# EAGLE design motherboard_v4 (EAGLE 9.1.3)
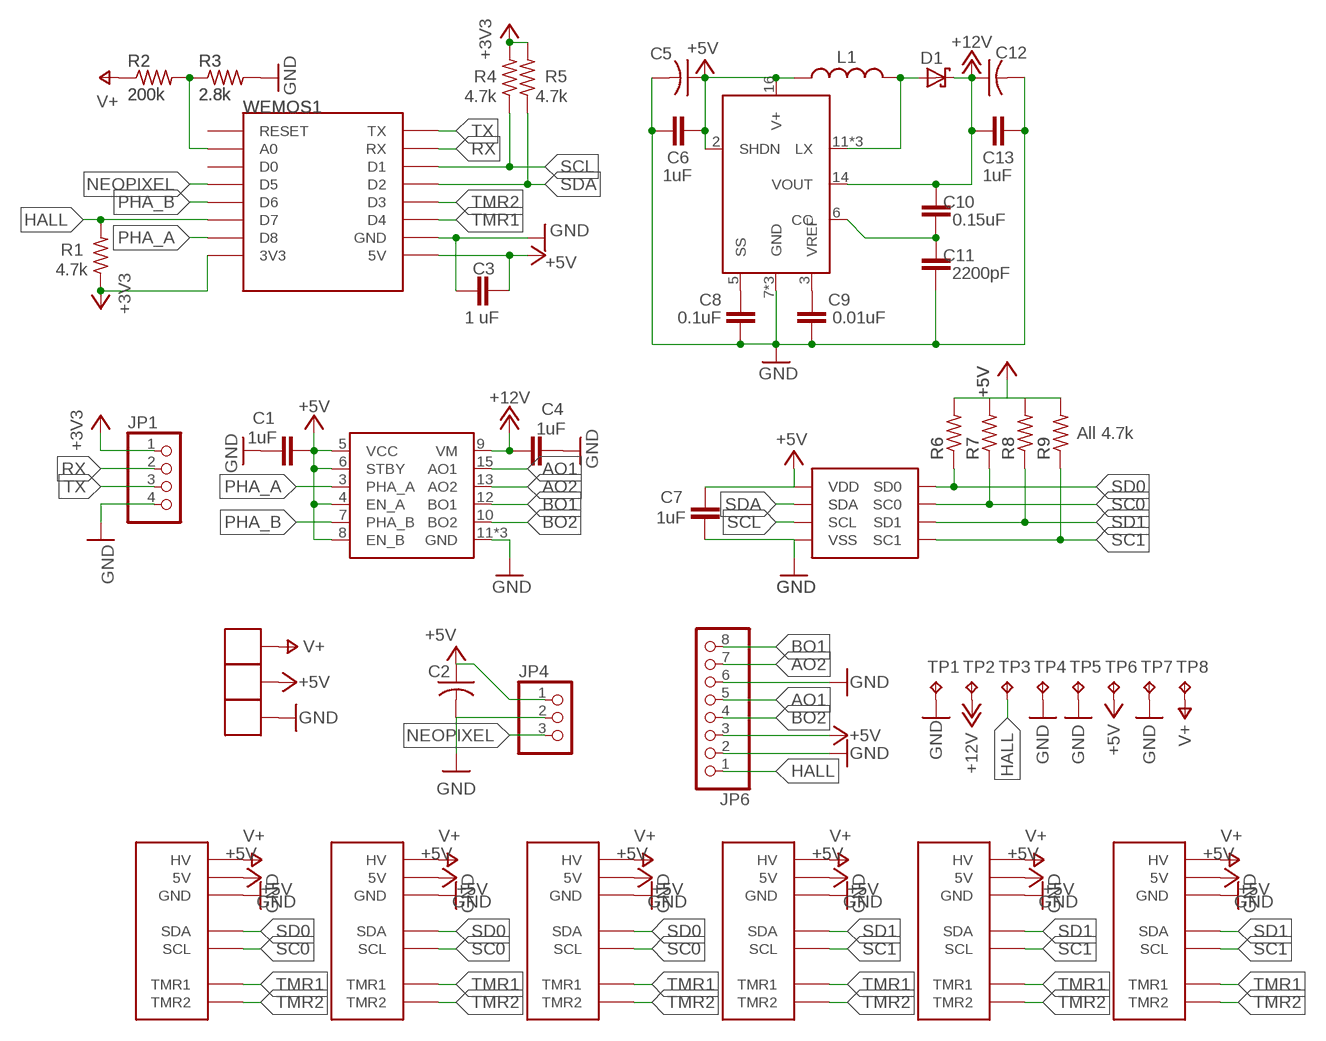
[diagram p0: schematic, sheet 1]

## Parts
C1  1uF  C-EUC1206  [C1206]
C2  UCM1H331MNL1GS  [CAPAE1030X1050]
C3  1 uF  C-EUC1206  [C1206]
C4  1uF  C-EUC1206  [C1206]
C5  UCM1H331MNL1GS  [CAPAE1030X1050]
C6  1uF  C-EUC1206  [C1206]
C7  1uF  C-EUC1206  [C1206]
C8  0.1uF  C-EUC1206  [C1206]
C9  0.01uF  C-EUC1206  [C1206]
C10  0.15uF  C-EUC1206  [C1206]
C11  2200pF  C-EUC1206  [C1206]
C12  UCM1H331MNL1GS  [CAPAE1030X1050]
C13  1uF  C-EUC1206  [C1206]
D1  NSR0530H  [SOD2512X100]
J1  PHOENIX_1731468  [PHOENIX_1731468]
J2  PHOENIX_1731468  [PHOENIX_1731468]
J3  PHOENIX_1731468  [PHOENIX_1731468]
JP1  PINHD-1X4  [1X04]
JP2  PCIE_SOCKET  [PCIE_SOCKET]
JP3  PCIE_SOCKET  [PCIE_SOCKET]
JP4  PINHD-1X3  [1X03]
JP5  PCIE_SOCKET  [PCIE_SOCKET]
JP6  PINHD-1X8  [1X08]
JP7  PCIE_SOCKET  [PCIE_SOCKET]
JP8  PCIE_SOCKET  [PCIE_SOCKET]
JP9  PCIE_SOCKET  [PCIE_SOCKET]
L1  NR6028  [NR6028]
R1  4.7k  R-US_R1206  [R1206]
R2  200k  R-US_R1206  [R1206]
R3  2.8k  R-US_R1206  [R1206]
R4  4.7k  R-US_R1206  [R1206]
R5  4.7k  R-US_R1206  [R1206]
R6  R-US_R1206  [R1206]
R7  R-US_R1206  [R1206]
R8  R-US_R1206  [R1206]
R9  R-US_R1206  [R1206]
TP1  TPB2,54  [B2,54]
TP2  TPB2,54  [B2,54]
TP3  TPB2,54  [B2,54]
TP4  TPB2,54  [B2,54]
TP5  TPB2,54  [B2,54]
TP6  TPB2,54  [B2,54]
TP7  TPB2,54  [B2,54]
TP8  TPB2,54  [B2,54]
U1  TC78H620FNG  [SSOP16]
U2  MAX732  [SOIC127P1032X265-16]
U3  PCA9540BDPSOIC8  [SOIC127P599X175-8]
WEMOS1  WEMOS-D1-MINISMD  [WEMOS-D1-MINI-SMD]

## Nets
+3V3: JP1.1 R1.1 R4.2 R5.2 WEMOS1.3V3
+5V: C1.2 C2.1 C3.2 C5.1 C6.1 C7.2 J2.P$1 J2.P$2 JP2.5V1(5V) JP2.5V2(5V) JP3.5V1(5V) JP3.5V2(5V) JP4.1 JP5.5V1(5V) JP5.5V2(5V) JP6.3 JP7.5V1(5V) JP7.5V2(5V) JP8.5V1(5V) JP8.5V2(5V) JP9.5V1(5V) JP9.5V2(5V) L1.1 R6.2 R7.2 R8.2 R9.2 TP6.TP U1.4(EN_A) U1.5(VCC) U1.6(STBY) U1.8(EN_B) U2.2(SHDN) U2.16(V+) U3.3(VDD) WEMOS1.5V
+12V: C4.1 C10.2 C12.1 C13.2 D1.1(C) TP2.TP U1.9(VM) U2.14(VOUT)
AO1: JP6.5 U1.15(AO1)
AO2: JP6.7 U1.13(AO2)
BO1: JP6.8 U1.12(BO1)
BO2: JP6.4 U1.10(BO2)
GND: C1.1 C2.2 C3.1 C4.2 C5.2 C6.2 C7.1 C8.1 C9.1 C11.1 C12.2 C13.1 J3.P$1 J3.P$2 JP1.4 JP2.GND1(GND) JP2.GND2(GND) JP3.GND1(GND) JP3.GND2(GND) JP4.2 JP5.GND1(GND) JP5.GND2(GND) JP6.2 JP6.6 JP7.GND1(GND) JP7.GND2(GND) JP8.GND1(GND) JP8.GND2(GND) JP9.GND1(GND) JP9.GND2(GND) R3.2 TP1.TP TP4.TP TP5.TP TP7.TP U1.11(GND) U1.14(GND) U1.16(GND) U2.7(GND) U2.8(GND) U2.9(GND) U3.6(VSS) WEMOS1.GND
HALL: JP6.1 R1.2 TP3.TP WEMOS1.D7
N$1: D1.2(A) L1.2 U2.11(LX) U2.12(LX) U2.13(LX)
N$3: C10.1 C11.2 U2.6(CC)
N$4: C9.2 U2.3(VREF)
N$5: C8.2 U2.5(SS)
N$23: R2.2 R3.1 WEMOS1.A0
NEOPIXEL: JP4.3 WEMOS1.D5
PHA_A: U1.3(PHA_A) WEMOS1.D8
PHA_B: U1.7(PHA_B) WEMOS1.D6
RX: JP1.2 WEMOS1.RX
SC0: JP2.SCL1(SCL) JP2.SCL2(SCL) JP3.SCL1(SCL) JP3.SCL2(SCL) JP5.SCL1(SCL) JP5.SCL2(SCL) R7.1 U3.5(SC0)
SC1: JP7.SCL1(SCL) JP7.SCL2(SCL) JP8.SCL1(SCL) JP8.SCL2(SCL) JP9.SCL1(SCL) JP9.SCL2(SCL) R9.1 U3.8(SC1)
SCL: R4.1 U3.1(SCL) WEMOS1.D1
SD0: JP2.SDA1(SDA) JP2.SDA2(SDA) JP3.SDA1(SDA) JP3.SDA2(SDA) JP5.SDA1(SDA) JP5.SDA2(SDA) R6.1 U3.4(SD0)
SD1: JP7.SDA1(SDA) JP7.SDA2(SDA) JP8.SDA1(SDA) JP8.SDA2(SDA) JP9.SDA1(SDA) JP9.SDA2(SDA) R8.1 U3.7(SD1)
SDA: R5.1 U3.2(SDA) WEMOS1.D2
TMR1: JP2.TMR1_1(TMR1) JP2.TMR1_2(TMR1) JP3.TMR1_1(TMR1) JP3.TMR1_2(TMR1) JP5.TMR1_1(TMR1) JP5.TMR1_2(TMR1) JP7.TMR1_1(TMR1) JP7.TMR1_2(TMR1) JP8.TMR1_1(TMR1) JP8.TMR1_2(TMR1) JP9.TMR1_1(TMR1) JP9.TMR1_2(TMR1) WEMOS1.D4
TMR2: JP2.TMR2_1(TMR2) JP2.TMR2_2(TMR2) JP3.TMR2_1(TMR2) JP3.TMR2_2(TMR2) JP5.TMR2_1(TMR2) JP5.TMR2_2(TMR2) JP7.TMR2_1(TMR2) JP7.TMR2_2(TMR2) JP8.TMR2_1(TMR2) JP8.TMR2_2(TMR2) JP9.TMR2_1(TMR2) JP9.TMR2_2(TMR2) WEMOS1.D3
TX: JP1.3 WEMOS1.TX
V+: J1.P$1 J1.P$2 JP2.HV1(HV) JP2.HV2(HV) JP3.HV1(HV) JP3.HV2(HV) JP5.HV1(HV) JP5.HV2(HV) JP7.HV1(HV) JP7.HV2(HV) JP8.HV1(HV) JP8.HV2(HV) JP9.HV1(HV) JP9.HV2(HV) R2.1 TP8.TP
Unconnected: WEMOS1.D0 WEMOS1.RST(RESET)

## Notes on the sheet
- All 4.7k

## Library data of the parts
C1 C3 C4 C6-C11 C13 = resistor:C-EU: CAPACITOR, European symbol
C2 C5 C12 = tide_clock:UCM1H331MNL1GS
D1 = tide_clock:NSR0530H
J1-J3 = tide_clock:PHOENIX_1731468
JP1 = pinhead:PINHD-1X4: PIN HEADER
JP2 JP3 JP5 JP7-JP9 = tide_clock:PCIE_SOCKET
JP4 = pinhead:PINHD-1X3: PIN HEADER
JP6 = pinhead:PINHD-1X8: PIN HEADER
L1 = tide_clock:NR6028
R1-R9 = resistor:R-US_: RESISTOR, American symbol
TP1-TP8 = testpad:TP: Test pad
U1 = tide_clock:TC78H620FNG
U2 = tide_clock:MAX732
U3 = tide_clock:PCA9540BDP
WEMOS1 = tide_clock:WEMOS-D1-MINI: WeMos.cc D1 mini ESP8266 module

## Board
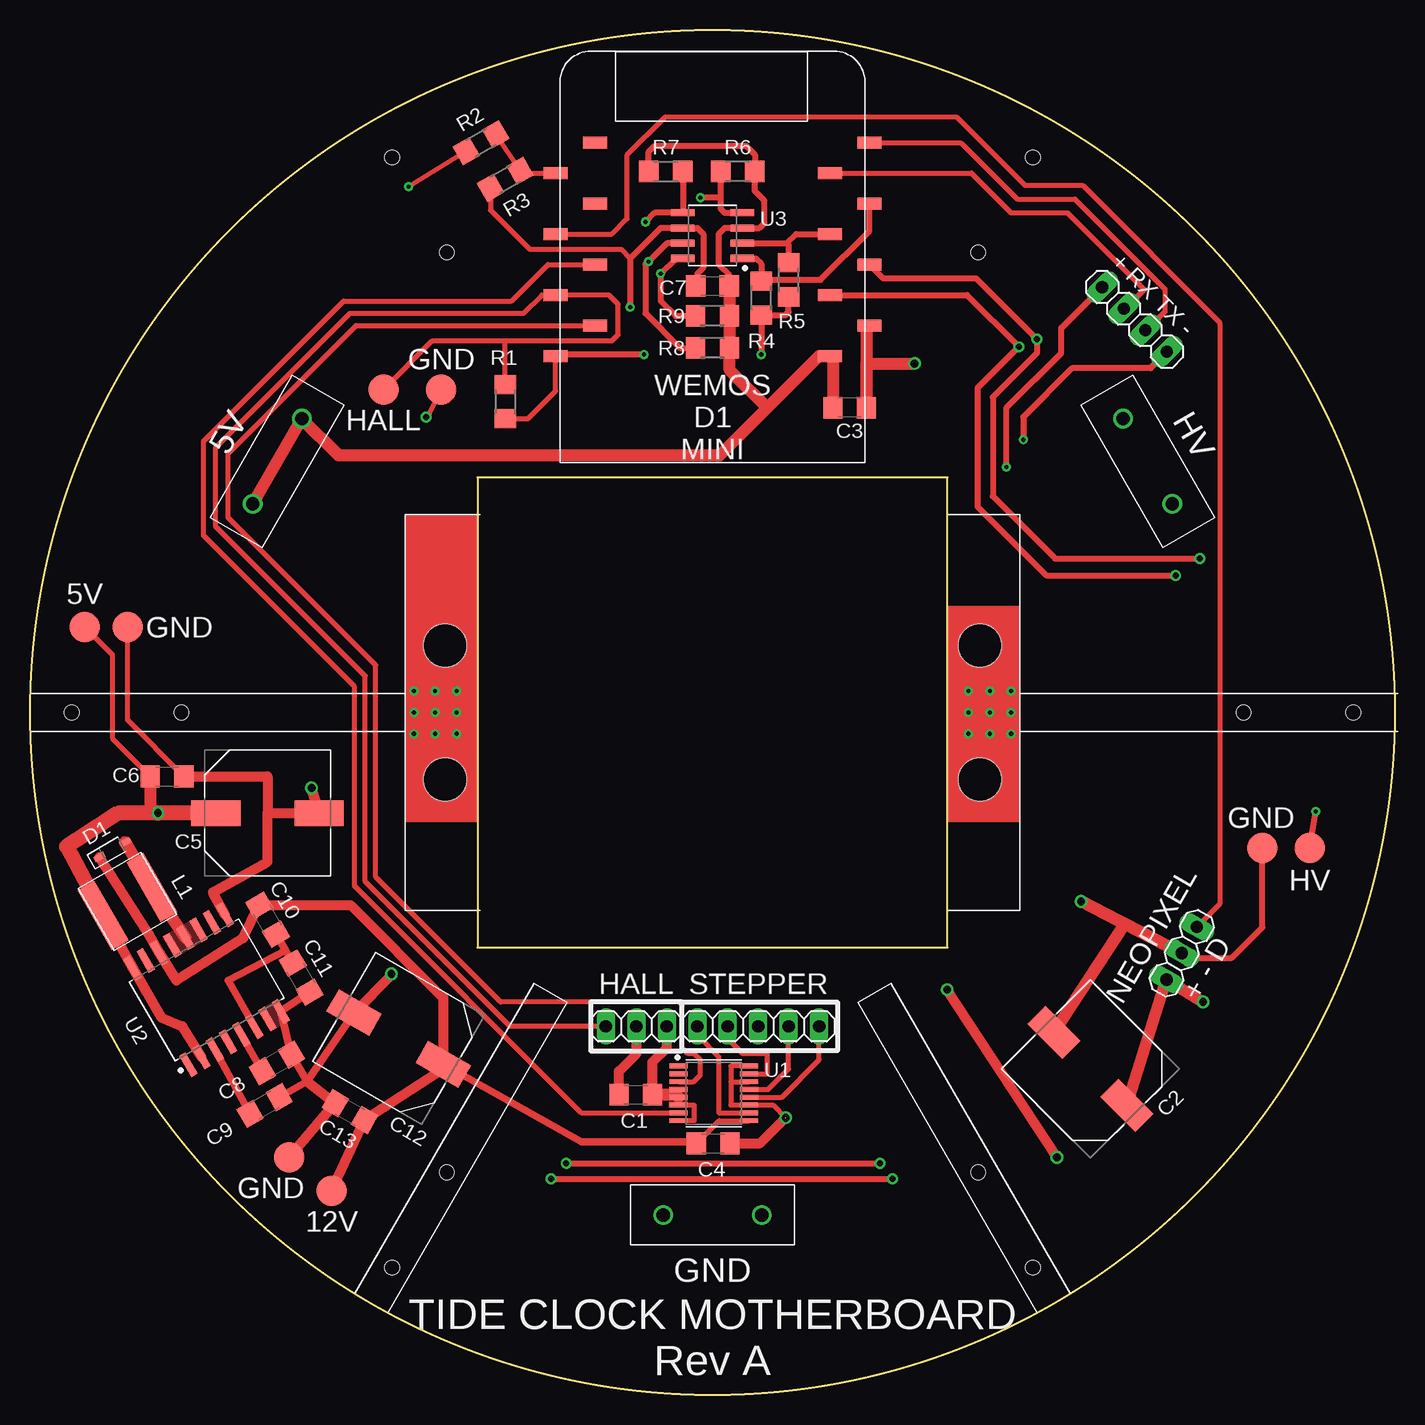
[diagram p1: board, top side]
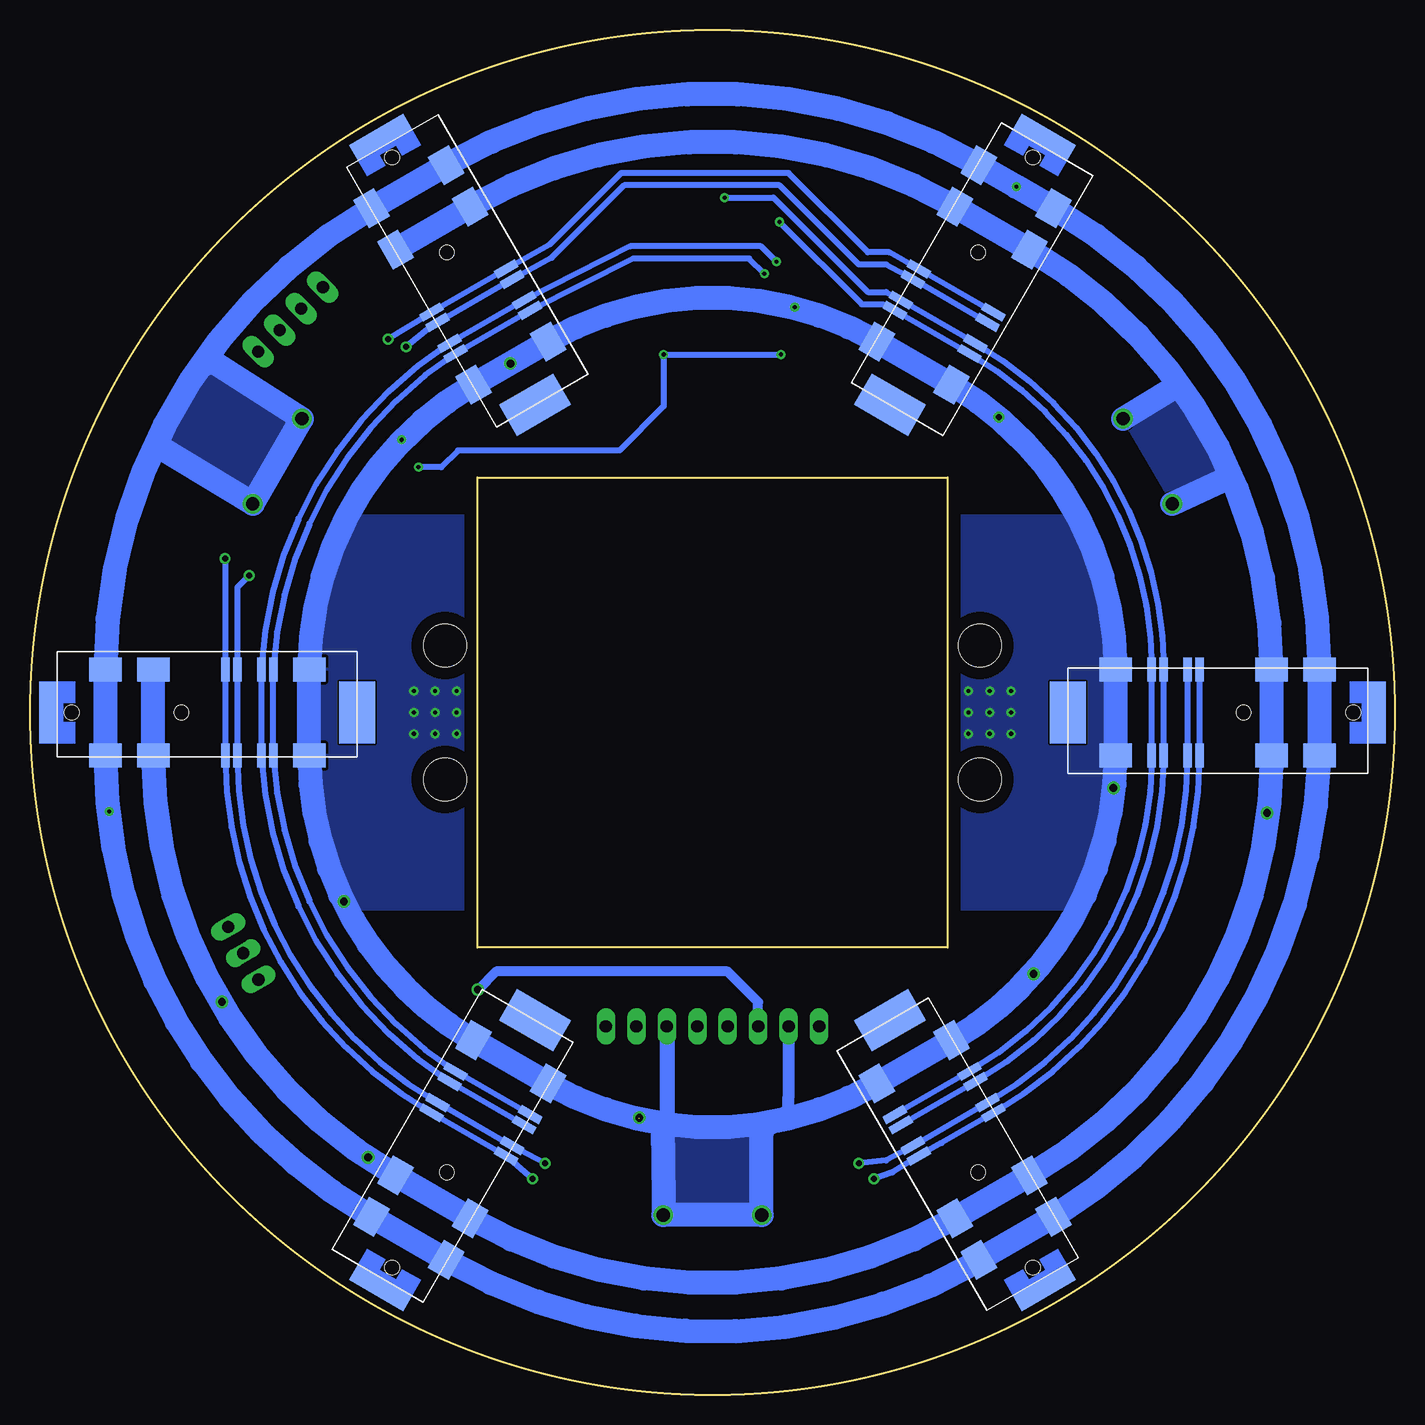
[diagram p2: board, bottom side, seen from below]

Size 113.79 x 113.79 mm. Coordinates in mm from the lower left corner, seen from the top.
Outline: 37.3,37.3 76.49,37.3 76.49,76.49 37.3,76.49 37.3,37.3
Outline: circle at 56.9,56.9 radius 56.9
Copper layers (1*16): Top 0.035mm / dielectric 1.5mm / Bottom 0.035mm
Design rules "default *": minimum track width 6mil, minimum drill 0.35mm, track to track 6mil, track to pad 6mil, pad to pad 6mil, via to via 6mil, smd to smd 6mil, copper to edge 40mil, drill to drill 6mil, minimum pad ring 10mil, minimum via ring 8mil, stop-mask expansion 4mil, vias tented up to drill 30mil, thermal gap 10mil
Holes 3.56 mm at 79.19,51.32 79.19,62.47 34.6,51.32 34.6,62.47
Milling: 4 lines

### Footprints (pad centres in the part's own frame; a part is rotated, then mirrored left to right if it is on the bottom)
C1206 = smd 1.6 x 1.8: 1 -1.4,0; 2 1.4,0
CAPAE1030X1050 = smd 4.11 x 2.12: 1 -4.299,0; 2 4.299,0
SOD2512X100 = smd 0.945 x 0.497: 1 -1.235,0; 2 1.235,0
PHOENIX_1731468 = drill 1.1: P$1 4.1,0; P$2 -4.1,0
1X04 = drill 1.016 long: 1 -3.81,0; 2 -1.27,0; 3 1.27,0; 4 3.81,0
PCIE_SOCKET = smd 2.7 x 2: 5V1 2.5,3.6; 5V2 2.5,-3.6; GND1 -10.5,3.6; GND2 -10.5,-3.6; HV1 6.5,3.6; HV2 6.5,-3.6 | smd 3 x 5.2: LEFT_TAB -14.5,0 | smd 1.5 x 5.2: RIGHT_TAB 11.25,0 | smd 0.7 x 2: SCL1 -7.5,3.6; SCL2 -7.5,-3.6; SDA1 -6.5,3.6; SDA2 -6.5,-3.6; TMR1_1 -4.5,3.6; TMR1_2 -4.5,-3.6; TMR2_1 -3.5,3.6; TMR2_2 -3.5,-3.6 | hole 1.2: 0.15,0; 9.3,0
1X03 = drill 1.016 long: 1 -2.54,0; 2 0,0; 3 2.54,0
1X08 = drill 1.016 long: 1 -8.89,0; 2 -6.35,0; 3 -3.81,0; 4 -1.27,0; 5 1.27,0; 6 3.81,0; 7 6.35,0; 8 8.89,0
NR6028 = smd 1.6 x 5.7: 1 -2.35,0; 2 2.35,0
R1206 = smd 1.6 x 1.803: 1 -1.422,0; 2 1.422,0
B2,54 = smd 2.54 x 2.54: TP 0,0
SSOP16 = smd 1.515 x 0.409: 1 -2.948,2.275; 2 -2.948,1.625; 3 -2.948,0.975; 4 -2.948,0.325; 5 -2.948,-0.325; 6 -2.948,-0.975; 7 -2.948,-1.625; 8 -2.948,-2.275; 9 2.948,-2.275; 10 2.948,-1.625; 11 2.948,-0.975; 12 2.948,-0.325; 13 2.948,0.325; 14 2.948,0.975; 15 2.948,1.625; 16 2.948,2.275
SOIC127P1032X265-16 = smd 2.052 x 0.602: 1 -4.654,4.445; 2 -4.654,3.175; 3 -4.654,1.905; 4 -4.654,0.635; 5 -4.654,-0.635; 6 -4.654,-1.905; 7 -4.654,-3.175; 8 -4.654,-4.445; 9 4.654,-4.445; 10 4.654,-3.175; 11 4.654,-1.905; 12 4.654,-0.635; 13 4.654,0.635; 14 4.654,1.905; 15 4.654,3.175; 16 4.654,4.445
SOIC127P599X175-8 = smd 1.972 x 0.599: 1 -2.472,1.905; 2 -2.472,0.635; 3 -2.472,-0.635; 4 -2.472,-1.905; 5 2.472,-1.905; 6 2.472,-0.635; 7 2.472,0.635; 8 2.472,1.905
WEMOS-D1-MINI-SMD = smd 2.007 x 0.991: 3V3 -13.081,-10.16; 5V 9.779,-10.16; A0 -13.081,5.08; D0 -9.779,2.54; D1 13.081,2.54; D2 9.779,0; D3 13.081,-2.54; D4 9.779,-5.08; D5 -13.081,0; D6 -9.779,-2.54; D7 -13.081,-5.08; D8 -9.779,-7.62; GND 13.081,-7.62; RST -9.779,7.62; RX 9.779,5.08; TX 13.081,7.62

### Placement (x,y rotation side)
C1  50.5,25.04 0 top
C2  88.39,27.18 135 top
C3  68.33,82.3 180 top
C4  56.95,20.98 0 top
C5  19.81,48.51 0 top
C6  11.43,51.56 0 top
C7  56.9,92.46 0 top
C8  20.57,27.69 210 top
C9  19.56,24.13 210 top
C10  19.81,39.62 120 top
C11  22.61,34.8 120 top
C12  30.73,29.72 150 top
C13  26.67,23.62 330 top
D1  6.86,45.47 30 top
J1  93.18,77.84 120 top
J2  20.61,77.84 60 top
J3  56.9,15 180 top
JP1  92.08,89.66 315 top
JP2  34.84,95.1 60 bottom
JP3  12.78,56.9 0 bottom
JP4  96.01,36.83 60 top
JP5  34.84,18.69 300 bottom
JP6  56.9,30.73 0 top
JP7  78.95,18.69 240 bottom
JP8  101.01,56.9 180 bottom
JP9  78.95,95.1 120 bottom
L1  8.13,41.15 30 top
R1  39.62,82.8 90 top
R2  37.59,104.39 30 top
R3  39.62,101.35 210 top
R4  60.96,91.44 270 top
R5  63.25,92.96 270 top
R6  59,102 0 top
R7  53,102 180 top
R8  56.9,87.29 0 top
R9  56.9,89.97 0 top
TP1  21.59,19.81 0 top
TP2  25.15,17.02 0 top
TP3  29.46,83.82 0 top
TP4  34.29,83.82 0 top
TP5  8.13,64.01 0 top
TP6  4.57,64.01 0 top
TP7  102.74,45.59 0 top
TP8  106.68,45.59 0 top
U1  57,25.15 0 top
U2  14.73,33.78 120 top
U3  56.89,96.65 180 top
WEMOS1  56.89,96.77 0 top

### Tracks (layer width: path | path; a pad name or v marks a point on that pad's centre or on a via)
+3V3  (via drill 0.35)
  Top 0.406: R1.1 41.5,81.38 43.81,83.69 WEMOS1.3V3
  Top 0.508: R5.2 63.25,90.3 62.97,90.02 R4.2 v60.96,86.74 | v51.18,86.74 43.94,86.74 WEMOS1.3V3 | v81.41,77.34 81.41,82.3 85.98,86.87 85.98,88.95 JP1.1
  Bottom 0.508: v51.18,86.74 v60.96,86.74 60.96,82.42 64.64,78.74 78.11,78.74 79.5,77.34 v81.41,77.34
+5V  (via drill 0.65)
  Top 0.406: U1.6 55.37,24.17 55.37,22.87 U1.8 | TP6.TP 6.86,61.72 6.86,54.73 C6.1
  Top 0.508: R7.2 51.58,103.65 52.07,104.14 59.69,104.14 60.42,103.41 R6.2 60.42,100.36 61.21,99.57 61.21,97.69 60.81,97.28 U3.3 57.91,97.28 57.4,96.77 57.4,94.23 58.3,93.34 C7.2
  Top 0.813: L1.1 U2.16 10.92,31.5 12.7,30.73 U2.2 | C1.2 51.9,27.77 53.09,28.96 JP6.3 | v76.45,33.78 v85.6,19.81
  Top 1.016: 61.47,82.3 57.52,78.34 25.71,78.34 J2.P$1 J2.P$2 | 61.47,82.3 65.79,86.61 WEMOS1.5V 66.93,86.61 C3.2 | C7.2 58.3,89.99 R9.2 R8.2 58.32,85.45 58.62,85.14 61.47,82.3 | C1.2 53.83,25.04 U1.5 | v97.79,32.77 JP4.1 C2.1 | C6.1 10.03,48.51 v10.67,48.51
  Top 1.27: C5.1 v10.67,48.51 7.37,48.51 3.05,45.72 L1.1
  Bottom 0.254: JP2.5V2 25.15,91.44 18.29,84.58 18.45,84.46 J2.P$1
  Bottom 0.813: JP6.3 53.09,32.77 55.63,35.31 74.93,35.31 v76.45,33.78 | v85.6,19.81 JP7.5V2 v85.6,19.81 | v85.6,19.81 90.68,23.62 96.01,29.72 v97.79,32.77
  Bottom 1.27: v10.67,48.51 JP3.5V2
  Bottom 2: J2.P$1 18.29,84.07 | J2.P$2 13.97,76.45 | JP8.5V2 JP8.5V1 arc-60 JP7.5V2 JP7.5V1 arc-60 JP5.5V2 JP5.5V1 arc-60 JP3.5V2 JP3.5V1 arc-60 JP2.5V2 JP2.5V1 arc-60 JP9.5V2 JP9.5V1
  pour Bottom: 13.72,76.45 18.54,74.17 22.86,81.53 18.29,84.33
  pour Top (no thermals): 53.29,25.65 54.81,25.65 54.81,23.98 53.29,23.98
+12V
  Top 0.406: C4.1 57.44,22.87 U1.9
  Top 0.61: C12.1 34.77,27.39 45.97,21.08 55.55,21.08 C4.1
  Top 0.813: D1.1 9.91,38.41 U2.14 12.19,34.54 17.78,38.1 C10.2 26.73,40.84 34.44,33.12 34.44,27.58 C12.1 | 34.77,27.39 C13.2 TP2.TP
AO1
  Top 0.406: U1.15 61.47,26.77 61.47,28.45 59.44,28.45 58.16,29.72 JP6.5
AO2
  Top 0.406: U1.13 61.54,25.47 63.25,27.18 63.24,27.18 JP6.7
BO1
  Top 0.406: U1.12 62.67,24.82 65.79,27.94 JP6.8
BO2
  Top 0.406: U1.10 57.4,23.52 57.4,28.19 55.62,29.97 JP6.4
GND  (via drill 0.35, 0.5, 0.65)  (1 unrouted)
  Top 0.406: U1.16 58.42,27.42 58.42,26.12 | 58.42,26.12 U1.14 | 58.42,26.12 58.42,24.17 U1.11 61.93,24.17 v62.99,23.11 | TP4.TP 33.27,81.79 v33.02,81.53 | C6.2 8.13,56.26 TP5.TP | 50.04,94.74 49.28,95.5 41.66,95.5 38.39,98.77 R3.2
  Top 0.508: v50.04,90.68 50.04,94.74 52.58,97.28 U3.6 55.63,97.28 56.13,96.77 56.13,93.98 55.63,93.47 55.63,92.59 C7.1 | JP4.2 96.39,36.45 100.2,36.45 102.74,38.99 TP7.TP | JP1.4 93.4,85.6 86.87,85.6 82.8,81.53 v82.8,79.63
  Top 0.61: C9.1 23.11,26.16 | 23.11,26.16 C8.1 U2.8 C11.1 | 23.11,26.16 C12.2
  Top 0.813: U2.9 15.24,41.91 19.81,44.45 19.81,48.51 | 19.81,48.51 C5.2 v23.47,50.6 | C12.2 30.18,35.04 v30.12,35.1 | C1.1 49.09,27 50.55,28.45 JP6.2 | C4.2 60.86,20.98 v62.99,23.11 | C6.2 19.81,51.56 19.81,48.51 | 23.11,26.16 C13.1 TP1.TP
  Top 1.016: WEMOS1.GND 69.73,89.15 C3.1 69.73,85.99 v73.74,85.99 | JP4.2 91.27,39.27 | 91.27,39.27 90.76,39.53 v87.63,41.15 | C2.2 91.27,39.27
  Bottom 0.254: v50.04,90.68 43.46,88.06 JP2.GND1 | 63.01,23.08 JP7.GND1 | v30.12,35.1 JP5.GND1
  Bottom 0.406: 61,22 63.01,23.08 | v73.74,85.99 JP9.GND2 | v33.02,81.53 JP2.GND2
  Bottom 0.508: v82.8,79.63 JP9.GND1
  Bottom 0.813: v23.47,50.6 JP3.GND2 | v87.63,41.15 89.41,45.72 90.16,49.09 90.42,50.29 JP8.GND1
  Bottom 1.016: JP6.2 50.55,24.89 50.55,23.88 52.8,21.8 | 52.8,21.8 JP5.GND2 52.8,21.8
  Bottom 1.27: JP6.6 60.7,20.83 61,20.83
  Bottom 2: 61,22 61,20.83 J3.P$2 J3.P$1 52.8,21.8 53,22 | JP3.GND1 arc-60 JP2.GND2 JP2.GND1 arc-60 JP9.GND2 JP9.GND1 arc-60 JP8.GND2 JP8.GND1 arc-60 JP7.GND2 JP7.GND1 arc-60 JP5.GND2 JP5.GND1 arc-60 JP3.GND2 JP3.GND1
  other vias: 32,58.67 33.78,58.67 35.56,58.67 32,56.9 33.78,56.9 35.56,56.9 32,55.12 33.78,55.12 35.56,55.12 78.23,58.67 80.01,58.67 81.79,58.67 78.23,56.9 80.01,56.9 81.79,56.9 78.23,55.12 80.01,55.12 81.79,55.12
  pour Bottom: 53.09,15.24 60.96,15.24 60.96,21.84 53.09,21.84
  pour Bottom: 52.83,15.24 60.96,15.24 60.96,22.1 52.58,22.1 52.58,15.24
  pour Top (no thermals): 19.1,32.11 20.62,32.97 21.64,31.24 20.07,30.33
  pour Bottom (no thermals): 37.34,73.41 26.42,73.41 24.13,66.55 23.37,61.98 23.37,54.86 24.13,46.74 26.16,41.91 26.92,40.39 37.34,40.39
  pour Bottom: 76.45,73.41 87.12,73.41 89.66,67.56 90.42,59.18 90.17,50.55 88.9,42.93 86.87,40.39 76.45,40.39
HALL
  Top 0.406: JP6.1 40.01,30.73 27.94,42.8 27.94,59.94 15.49,72.39 15.49,78.99 26.04,89.53 26.67,90.17 41.15,90.17 42.67,91.69 WEMOS1.D7 48.26,91.69 49.02,90.93 49.02,88.39 48.51,87.88 39.62,87.88 | TP3.TP 33.53,87.88 39.62,87.88 | R1.2 39.62,87.88
N$1
  Top 1.016: U2.12 L1.2 D1.2
  pour Top (no thermals): 11.13,38.25 13.77,39.78 14.78,38 12.14,36.47
N$3
  Top 0.61: C10.1 21.3,37.06 | 21.3,37.06 C11.2 | 21.3,37.06 16.51,34.54 U2.6
N$4
  Top 0.61: U2.3 C9.2
N$5
  Top 0.61: U2.5 C8.2
N$23
  Top 0.406: R2.2 R3.1 41.06,101.85 WEMOS1.A0
NEOPIXEL
  Top 0.406: WEMOS1.D5 48.51,96.77 49.78,98.04 49.78,103.38 52.96,106.55 77.22,106.55 82.93,100.84 87.76,100.84 99.19,89.41 99.19,40.94 JP4.3
PHA_A
  Top 0.406: U1.3 55.33,26.12 55.88,26.67 55.88,27.94 55.37,28.45 54.86,28.45 54.36,28.96 54.36,32.51 54.1,32.77 39.24,32.77 28.83,43.18 28.83,60.83 16.51,73.15 16.51,78.49 27.18,89.15 WEMOS1.D8
PHA_B
  Top 0.406: U1.7 45.95,23.52 27.05,42.42 27.05,59.05 14.48,71.63 14.48,79.5 26.16,91.19 40.13,91.19 43.18,94.23 WEMOS1.D6
RX
  Top 0.406: WEMOS1.RX 78.49,101.85 81.79,98.55 86.49,98.55 92.9,92.14 91.32,90.56 JP1.2
SC0  (via drill 0.35)
  Top 0.508: R7.1 U3.5 52.07,98.55 v51.31,97.79
  Bottom 0.508: v51.31,97.79 44.45,90.93 42.67,90.93 JP2.SCL1 JP2.SCL2 arc60 JP3.SCL1 JP3.SCL2 arc60 JP5.SCL1 JP5.SCL2
SC1  (via drill 0.35)
  Top 0.508: U3.8 53.85,94.74 v52.58,93.47 52.58,91.19 53.85,89.92 53.9,89.97 R9.1
  Bottom 0.508: v52.58,93.47 53.85,94.74 63.5,94.74 JP9.SCL2 JP9.SCL1 arc-54 JP8.SCL2 JP8.SCL1 arc-54 JP7.SCL2 JP7.SCL1
SCL
  Top 0.508: WEMOS1.D1 69.98,97.03 65.91,92.96 61.06,92.96 R4.1 60.96,94.29 60.51,94.74 U3.1
SD0  (via drill 0.35)
  Top 0.508: R6.1 57.58,99.82 | 57.58,99.82 57.58,98.89 57.91,98.55 U3.4 | 57.58,99.82 v55.88,99.82
  Bottom 0.508: v55.88,99.82 51.82,99.82 43.94,91.95 42.42,91.95 JP2.SDA1 JP2.SDA2 arc60 JP3.SDA1 JP3.SDA2 arc60 JP5.SDA1 JP5.SDA2
SD1  (via drill 0.35)
  Top 0.508: U3.7 53.09,96.01 v51.56,94.49 51.31,94.23 51.31,90.17 54.19,87.29 R8.1
  Bottom 0.508: v51.56,94.49 52.83,95.76 63.75,95.76 JP9.SDA2 JP9.SDA1 arc-54 JP8.SDA2 JP8.SDA1 arc-54 JP7.SDA2 JP7.SDA1
SDA
  Top 0.508: U3.2 63.12,96.01 | 63.12,96.01 63.88,96.77 WEMOS1.D2 | 63.12,96.01 63.25,95.89 R5.1
TMR1  (via drill 0.5)
  Top 0.508: WEMOS1.D4 78.11,91.69 v82.42,87.38 78.99,83.95 78.99,74.04 84.71,68.33 v95.5,68.33 | v44.7,19.3 v70.87,19.3
  Bottom 0.508: JP9.TMR1_2 73.77,92.9 | 73.77,92.9 JP9.TMR1_1 80.45,89.03 v82.42,87.38 | v95.5,68.33 96.51,67.32 JP8.TMR1_2 JP8.TMR1_1 arc-60 JP7.TMR1_2 JP7.TMR1_1 v70.87,19.3 | v44.7,19.3 42.42,19.56 JP5.TMR1_2 JP5.TMR1_1 arc-60 JP3.TMR1_2 JP3.TMR1_1 | JP2.TMR1_2 JP2.TMR1_1 42.42,94.23 44.7,94.23 51.31,100.84 64.26,100.84 70.31,94.8 73.77,92.9
TMR2  (via drill 0.5)
  Top 0.508: WEMOS1.D3 71.12,93.09 78.87,93.09 v83.95,88.01 83.95,86.87 80.26,83.19 80.26,74.93 85.47,69.72 v97.54,69.72 | v43.43,18.03 v71.88,18.03
  Bottom 0.508: v83.95,88.01 80.55,90.04 JP9.TMR2_1 JP9.TMR2_2 70.47,95.9 64.52,101.85 50.55,101.85 43.94,95.25 42.16,95.25 JP2.TMR2_1 JP2.TMR2_2 | v97.54,69.72 97.54,60.49 JP8.TMR2_2 JP8.TMR2_1 arc-60 JP7.TMR2_2 JP7.TMR2_1 v71.88,18.03 | v43.43,18.03 41.91,18.54 JP5.TMR2_2 37.81,21.01 JP5.TMR2_1 arc-60 JP3.TMR2_2 JP3.TMR2_1
TX
  Top 0.406: WEMOS1.TX 77.6,104.39 82.3,99.69 87.12,99.69 94.61,92.2 94.61,90.3 93.08,88.76 JP1.3
V+  (via drill 0.35)
  Top 0.406: R2.1 31.58,100.72 v31.57,100.72
  Top 0.508: TP8.TP v107.19,48.64
  Bottom 0.254: JP9.HV1 92.96,93.22 99,86
  Bottom 0.508: v107.19,48.64 JP8.HV1
  Bottom 2: 35,11 arc59 JP7.HV1 JP7.HV2 arc60 JP8.HV1 JP8.HV2 arc60 JP9.HV1 JP9.HV2 arc60 JP2.HV1 v31.57,100.72 JP2.HV2 arc60 JP3.HV1 JP3.HV2 arc56 JP5.HV1 JP5.HV2 | 103,79 J1.P$2 J1.P$1 98.88,86.36 99,86
  pour Bottom: 91.19,81.53 95.25,74.17 103.38,79.25 99.06,86.36
(copper drawn outside any net)
  shapes: Top area x4

### Text on the board
tPlace: + RX TX -
tNames: GND | HALL | 5V | HV | 5V | GND | GND | L1 | HV | NEOPIXEL | + - D | HALL | STEPPER | GND | 12V | GND | TIDE CLOCK MOTHERBOARD / Rev A